# EAGLE design SparkFun_Buck-Boost (EAGLE 9.1.1)
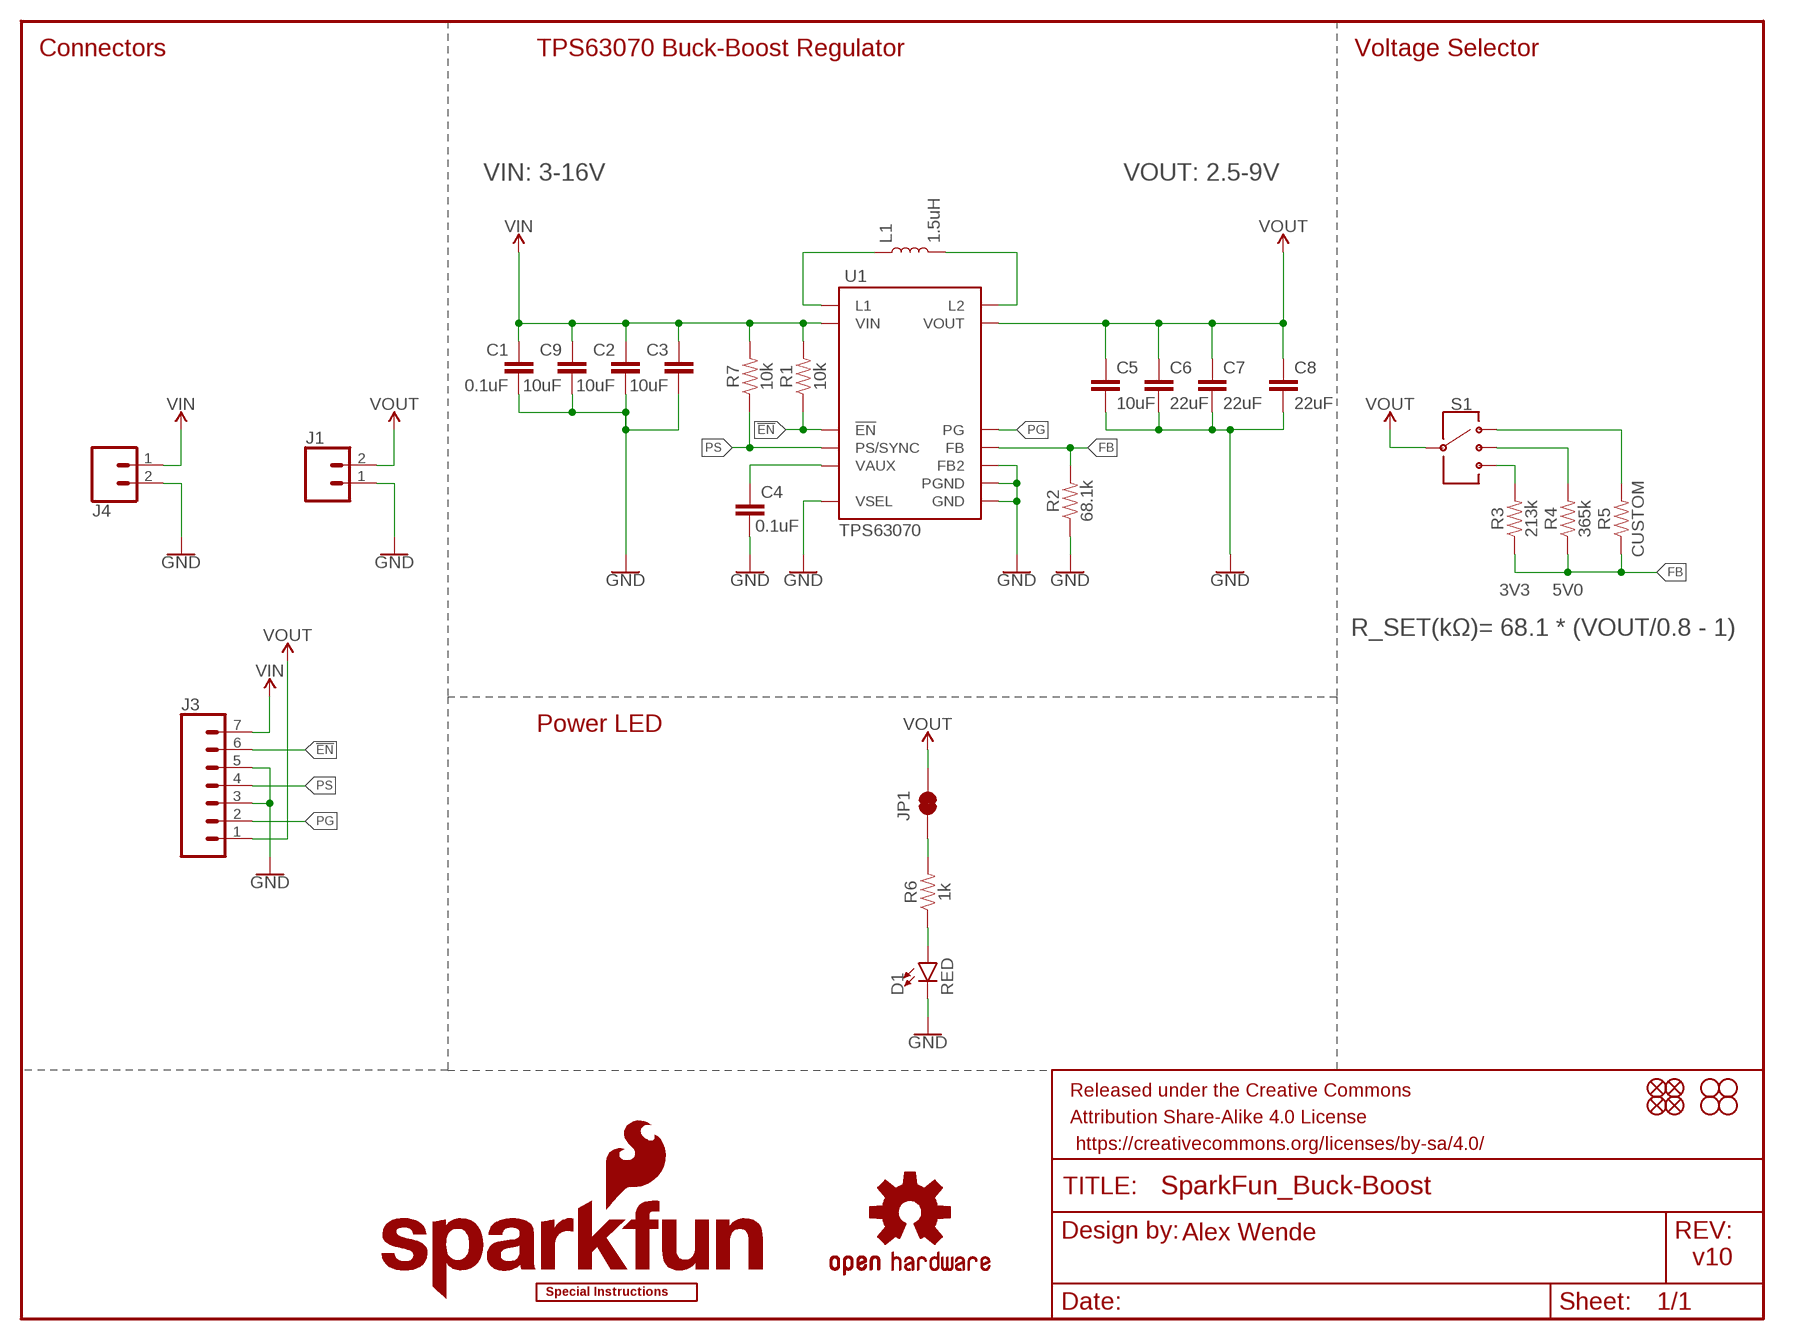
[diagram p0: schematic, sheet 1]

## Parts
C1  0.1uF  0.1UF-0603-25V-(+80/-20%)  [0603]
C2  10uF  10UF-0805-25V-10%  [0805]
C3  10uF  10UF-0805-25V-10%  [0805]
C4  0.1uF  0.1UF-0603-25V-(+80/-20%)  [0603]
C5  10uF  10UF-0805-25V-10%  [0805]
C6  22uF  22UF-0805-16V-20%  [0805]
C7  22uF  22UF-0805-16V-20%  [0805]
C8  22uF  22UF-0805-16V-20%  [0805]
C9  10uF  10UF-0805-25V-10%  [0805]
D1  RED  LED-RED0603  [LED-0603]
FD1  FIDUCIALUFIDUCIAL  [FIDUCIAL-MICRO]
FD2  FIDUCIALUFIDUCIAL  [FIDUCIAL-MICRO]
FD3  FIDUCIALUFIDUCIAL  [FIDUCIAL-MICRO]
FD4  FIDUCIALUFIDUCIAL  [FIDUCIAL-MICRO]
FRAME1  FRAME-LETTER  [CREATIVE_COMMONS]
H1  STAND-OFF  [STAND-OFF]
H2  STAND-OFF  [STAND-OFF]
H3  STAND-OFF  [STAND-OFF]
H4  STAND-OFF  [STAND-OFF]
J1  CONN_023.5MM-NO_SILK  [SCREWTERMINAL-3.5MM-2-NS]
J3  CONN_07NO_SILK  [1X07_NO_SILK]
J4  CONN_023.5MM-NO_SILK  [SCREWTERMINAL-3.5MM-2-NS]
JP1  JUMPER-SMT_2_NC_TRACE_NO-SILK  [SMT-JUMPER_2_NC_TRACE_NO-SILK]
L1  1.5uH  INDUCTOR-XFL40201.5UH  [XFL4020]
LOGO1  SFE_LOGO_NAME_FLAME.1_INCH  [SFE_LOGO_NAME_FLAME_.1]
LOGO2  OSHW-LOGOS  [OSHW-LOGO-S]
LOGO3  SPECIAL_INSTRUCTIONS-ORDERING  [ORDERING_INSTRUCTIONS]
R1  10k  10KOHM-0603-1/10W-1%  [0603]
R2  68.1k  68.1KOHM-0603-1/10W-1%  [0603]
R3  213k  213KOHM-0603-1/10W-0.1%  [0603]
R4  365k  365KOHM-0603-1/10W-1%  [0603]
R5  CUSTOM  RESISTORAXIAL-0.3  [AXIAL-0.3]
R6  1k  1KOHM-0603-1/10W-1%  [0603]
R7  10k  10KOHM-0603-1/10W-1%  [0603]
S1  SWITCH-SP3T-SMD  [SWITCH_SP3T_SMD]
U1  TPS63070  [VQFN-15-HR(3X2.5)]

## Nets
!EN: J3.6 R1.1 U1.P$14(!EN)
FB: R2.2 R3.1 R4.1 R5.P$1 U1.P$5(FB)
GND: C1.2 C2.2 C3.2 C4.2 C5.2 C6.2 C7.2 C8.2 C9.2 D1.C J1.1 J3.3 J3.5 J4.2 R2.1 U1.P$4(GND) U1.P$6(FB2) U1.P$10(PGND) U1.P$15(VSEL)
N$1: L1.P$1 U1.P$11(L1)
N$2: L1.P$2 U1.P$9(L2)
N$4: R5.P$2 S1.1
N$5: R4.2 S1.2
N$6: C4.1 U1.P$3(VAUX)
N$7: R3.2 S1.4
N$8: JP1.1 R6.2
N$9: D1.A R6.1
PG: J3.2 U1.P$2(PG)
PS: J3.4 R7.1 U1.P$1(PS/SYNC)
VIN: C1.1 C2.1 C3.1 C9.1 J3.7 J4.1 R1.2 R7.2 U1.P$12/13(VIN)
VOUT: C5.1 C6.1 C7.1 C8.1 J1.2 J3.1 JP1.2 S1.3 U1.P$7/8(VOUT)

## Notes on the sheet
- Connectors | TPS63070 Buck-Boost Regulator | Voltage Selector
- VIN: 3-16V | VOUT: 2.5-9V
- 3V3 | 5V0
- R_SET(kΩ)= 68.1 * (VOUT/0.8 - 1)
- Power LED
- Alex Wende
- v10

## Library data of the parts
C1 C4 = SparkFun-Capacitors:0.1UF: 0.1µF ceramic capacitors A capacitor is a passive two-terminal electrical component used to store electrical energy temporarily in an electric field.; PROD_ID: CAP-00810
C2 C3 C5 C9 = SparkFun-Capacitors:10UF: 10.0µF ceramic capacitors A capacitor is a passive two-terminal electrical component used to store electrical energy temporarily in an electric field.; PROD_ID: CAP-14259
C6-C8 = SparkFun-Capacitors:22UF: 22µF ceramic capacitors A capacitor is a passive two-terminal electrical component used to store electrical energy temporarily in an electric field.; PROD_ID: CAP-14260
D1 = SparkFun-LED:LED-RED: Red SMD LED Used in manufacturing of most products at SparkFun Packages: 0603 - SMD 0603 package [Product Link] <http://docs.avagotech.com/docs/AV02-0551EN> 0603 SMART - SMD 0603 SMART package ( more efficient and expensive)[Product Link] <http://www.osram-os.com/Graphics/XPic2/00077099_0.pdf> 1206 - SMD1206 package [Product Link] <https://www.sparkfun.com/datasheets/DevTools/LilyPad/Q150OVS4.pdff> SparkFun Products: Pro Mini 328 -5V <https://www.sparkfun.com/products/821> RedBoard <https://www.sparkfun.com/products/12757> IOIO-OTG <https://www.sparkfun.com/products/13613>; PROD_ID: DIO-00819
FD1-FD4 = SparkFun-Aesthetics:FIDUCIAL: Fiducial Alignment Points Point-of-reference for pick-and-place machines and other optical instruments.
FRAME1 = SparkFun-Aesthetics:FRAME-LETTER: Schematic Frame - Letter Standard 8.5x11 US Letter frame
H1-H4 = SparkFun-Hardware:STAND-OFF: Stand Off Drill holes for mechanically mounting via screws, standoffs, etc. Note: Use the keepout ring to avoid running the screw head into surrounding components. Variant Overviews STAND-OFF - Mechanical footprint for a #4 phillips button head screw. STAND-OFF-TIGHT - Mechanical footprint for a #4 phillips button head screw, Example SparkFun Products Screw - Phillips Head (1/4", 4-40, 10 pack) <https://www.sparkfun.com/products/10453> (PRT-10453) Screw - Phillips Head (1/2", 4-40, 10 pack) <https://www.sparkfun.com/products/10452> (PRT-10452) Screw - Phillips Head (3/4", 4-40, 10 pack) <https://www.sparkfun.com/products/10451> (PRT-10451) Screw - Phillips Head (1", 4-40, 10 pack) <https://www.sparkfun.com/products/10450> (PRT-10450)
J1 J4 = SparkFun-Connectors:CONN_02: Multi connection point. Often used as Generic Header-pin footprint for 0.1 inch spaced/style header connections On any of the 0.1 inch spaced packages, you can populate with these: Break Away Headers - Straight <https://www.sparkfun.com/products/116> (PRT-00116) Break Away Male Headers - Right Angle <https://www.sparkfun.com/products/553> (PRT-00553) Female Headers <https://www.sparkfun.com/products/115> (PRT-00115) Break Away Headers - Machine Pin <https://www.sparkfun.com/products/117> (PRT-00117) Break Away Female Headers - Swiss Machine Pin <https://www.sparkfun.com/products/743> (PRT-00743) For SCREWTERMINALS and SPRING TERMINALS visit here: Screw Terimnals on SparkFun.com <https://www.sparkfun.com/search/results?term=Screw+Terminals> (5mm/3.5mm/2.54mm spacing) This device is also useful as a general connection point to wire up your design to another part of your project. Our various solder wires solder well into these plated through hole pads. Hook-Up Wire - Assortment (Stranded, 22 AWG) <https://www.sparkfun.com/products/11375> (PRT-11375) Hook-Up Wire - Assortment (Solid Core, 22 AWG) <https://www.sparkfun.com/products/11367> (PRT-11367) View the entire wire category on our website here <https://www.sparkfun.com/categories/141> Special notes: Molex polarized connector foot print use with: PRT-08233 with associated crimp pins and housings. 2.54_SCREWTERM for use with PRT-10571. 3.5mm Screw Terminal footprints for PRT-08084 5mm Screw Terminal footprints for use with PRT-08432; PROD_ID: CONN-08399
J3 = SparkFun-Connectors:CONN_07: Multi connection point. Often used as Generic Header-pin footprint for 0.1 inch spaced/style header connections On any of the 0.1 inch spaced packages, you can populate with these: Break Away Headers - Straight <https://www.sparkfun.com/products/116> (PRT-00116) Break Away Male Headers - Right Angle <https://www.sparkfun.com/products/553> (PRT-00553) Female Headers <https://www.sparkfun.com/products/115> (PRT-00115) Break Away Headers - Machine Pin <https://www.sparkfun.com/products/117> (PRT-00117) Break Away Female Headers - Swiss Machine Pin <https://www.sparkfun.com/products/743> (PRT-00743) For SCREWTERMINALS and SPRING TERMINALS visit here: Screw Terimnals on SparkFun.com <https://www.sparkfun.com/search/results?term=Screw+Terminals> (5mm/3.5mm/2.54mm spacing) This device is also useful as a general connection point to wire up your design to another part of your project. Our various solder wires solder well into these plated through hole pads. Hook-Up Wire - Assortment (Stranded, 22 AWG) <https://www.sparkfun.com/products/11375> (PRT-11375) Hook-Up Wire - Assortment (Solid Core, 22 AWG) <https://www.sparkfun.com/products/11367> (PRT-11367) View the entire wire category on our website here <https://www.sparkfun.com/categories/141> Special notes: Molex polarized connector foot print use with SKU : PRT-08231 with associated crimp pins and housings. 1MM SMD Version SKU: PRT-10208 NOTES ON THE VARIANTS LOCK and LOCK_LONGPADS... This footprint was designed to help hold the alignment of a through-hole component (i.e. 6-pin header) while soldering it into place. You may notice that each hole has been shifted either up or down by 0.005 of an inch from it's more standard position (which is a perfectly straight line). This slight alteration caused the pins (the squares in the middle) to touch the edges of the holes. Because they are alternating, it causes a "brace" to hold the component in place. 0.005 has proven to be the perfect amount of "off-center" position when using our standard breakaway headers. Although looks a little odd when you look at the bare footprint, once you have a header in there, the alteration is very hard to notice. Also,if you push a header all the way into place, it is covered up entirely on the bottom side.
JP1 = SparkFun-Jumpers:JUMPER-SMT_2_NC_TRACE: Normally closed trace jumper This jumper has a trace between two pads so it's normally closed (NC). Use a razor knife to open the connection. For best results follow the IPC guidelines for cutting traces: Cutout at least 0.063 mm (0.005 in). Remove all loose material to clean up the cut area. Seal the cut with an approved epoxy. Reapply solder to reclose the connection.
L1 = SparkFun-Coils:INDUCTOR-XFL4020; PROD_ID: INDUC-13855
LOGO1 = SparkFun-Aesthetics:SFE_LOGO_NAME_FLAME: SparkFun Font Logo w/ Flame This is the SparkFun full logo. The logo on the schematic will always be the same size; the package variant is the height of the flame part of the logo. Default layer for the logo on the board is tSilk.
LOGO2 = SparkFun-Aesthetics:OSHW-LOGO: Open-Source Hardware (OSHW) Logo This logo indicates the piece of hardware it is found on incorporates a OSHW license and/or adheres to the definition of open source hardware found here: http://freedomdefined.org/OSHW
LOGO3 = SparkFun-Aesthetics:SPECIAL_INSTRUCTIONS: Special Ordering/Production Instructions Alert Symbol for special PCB ordering instructions or unique production process warnings. Ordering Instructions Production Instructions Types of information that should be added to box: Copper weight Soldermask color Silk color PCB thickness Number of layers PCB Standard: 1.6mm FR4 1 oz copper immersion silver plating red soldermask white silkscreen Types of information that should be added to box: Special wash requirements Depaneling instructions Humidification Glue curing Default text settings: 0.07 inch 9% ratio 50% line distance
R1 R7 = SparkFun-Resistors:10KOHM: 10kΩ resistor A resistor is a passive two-terminal electrical component that implements electrical resistance as a circuit element. Resistors act to reduce current flow, and, at the same time, act to lower voltage levels within circuits. - Wikipedia; PROD_ID: RES-00824
R2 = SparkFun-Resistors:68.1KOHM: 68.1kΩ resistor A resistor is a passive two-terminal electrical component that implements electrical resistance as a circuit element. Resistors act to reduce current flow, and, at the same time, act to lower voltage levels within circuits. - Wikipedia; PROD_ID: RES-09380
R3 = SparkFun-Resistors:213KOHM; PROD_ID: RES-14261
R4 = SparkFun-Resistors:365KOHM; PROD_ID: RES-14262
R5 = SparkFun-Resistors:RESISTOR: Generic Resistor Package
R6 = SparkFun-Resistors:1KOHM: 1kΩ resistor A resistor is a passive two-terminal electrical component that implements electrical resistance as a circuit element. Resistors act to reduce current flow, and, at the same time, act to lower voltage levels within circuits. - Wikipedia; PROD_ID: RES-07856
S1 = SparkFun-Switches:SWITCH-SP3T: Single-Pole, Triple-Throw (SP3T) Switch Single-Pole, Triple-Throw switches SparkFun Products Prototype Part; PROD_ID: SWCH-10805
U1 = SparkFun-IC-Power:TPS63070; PROD_ID: IC-14258

## Board
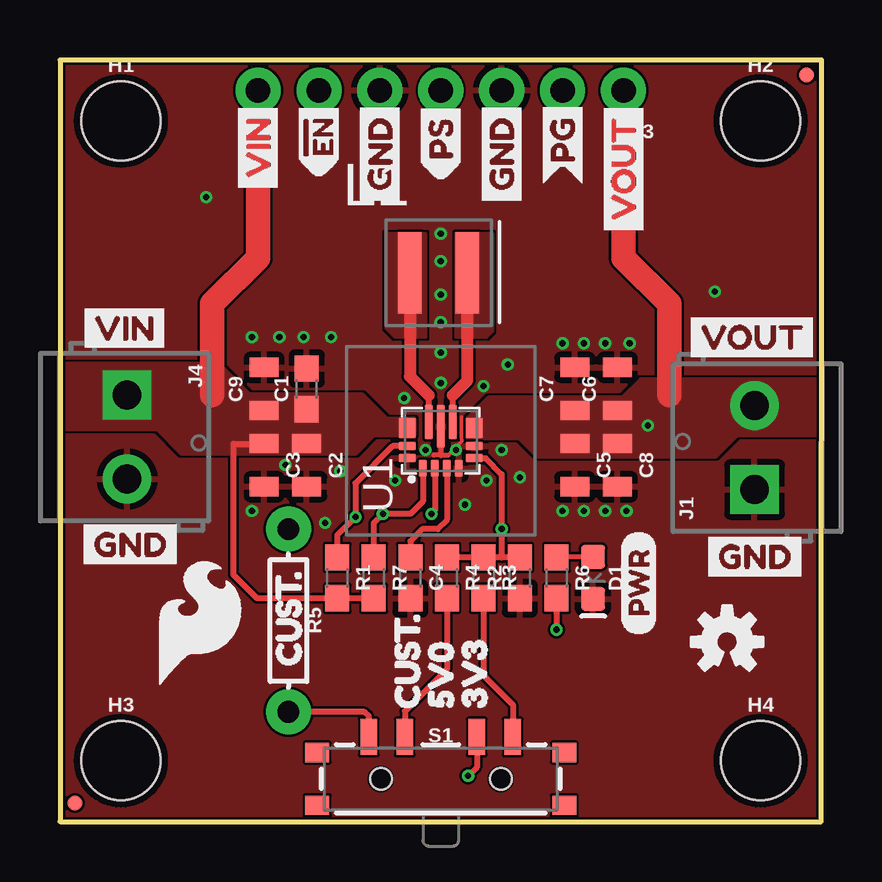
[diagram p1: board, top side]
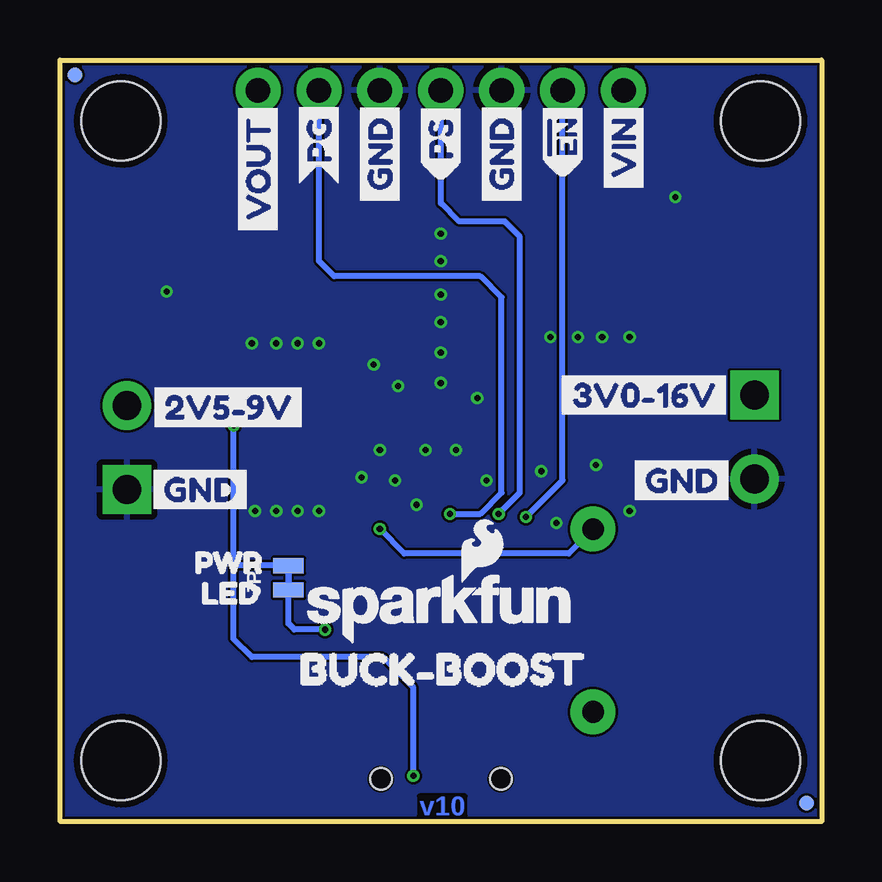
[diagram p2: board, bottom side, seen from below]

Size 31.75 x 31.75 mm. Coordinates in mm from the lower left corner, seen from the top.
Outline: 0,0 31.73,0 31.75,31.75 0,31.75 0,0
Copper layers (1*16): Top 0.035mm / dielectric 1.5mm / Bottom 0.035mm
Design rules "SparkFun-2-layer-FAB-LIMIT": minimum track width 4mil, minimum drill 6mil, track to track 4mil, track to pad 4mil, pad to pad 4mil, via to via 4mil, smd to smd 4mil, copper to edge 4mil, drill to drill 4mil, minimum pad ring 5mil, minimum via ring 5mil, stop-mask expansion 4mil, vias tented up to drill 25mil, thermal gap 10mil

### Footprints (pad centres in the part's own frame; a part is rotated, then mirrored left to right if it is on the bottom)
0603 = smd 1.1 x 1: 1 -0.85,0; 2 0.85,0
0805 = smd 0.8 x 1.2: 1 -0.9,0; 2 0.9,0
LED-0603 = smd 1 x 1: A -0.877,0; C 0.877,0
FIDUCIAL-MICRO = smd 0.635 x 0.635: 1 0,0
STAND-OFF = hole 3.302: 0,0
SCREWTERMINAL-3.5MM-2-NS = drill 1.2 pad 2.032 square: 1 0,0 | drill 1.2 pad 2.032: 2 3.5,0
1X07_NO_SILK = drill 1.016 pad 1.88: 1 0,0; 2 2.54,0; 3 5.08,0; 4 7.62,0; 5 10.16,0; 6 12.7,0; 7 15.24,0
SMT-JUMPER_2_NC_TRACE_NO-SILK = smd 0.635 x 1.27: 1 -0.508,0; 2 0.508,0
XFL4020 = smd 0.98 x 3.4: P$1 1,1.8; P$2 3.4,1.8
AXIAL-0.3 = drill 0.9 pad 1.88: P$1 -3.81,0; P$2 3.81,0
SWITCH_SP3T_SMD = smd 0.7 x 1.5: 1 3,-1.75; 2 1.5,-1.75; 3 -1.5,-1.75; 4 -3,-1.75 | smd 1 x 0.8: P$1 -5.15,-1.1; P$2 -5.15,1.1; P$3 5.15,1.1; P$4 5.15,-1.1 | hole 0.9: 2.5,0; -2.5,0
VQFN-15-HR(3X2.5) = smd 0.7 x 0.35: P$1 -1.15,0.75; P$2 -1.15,0.25; P$3 -1.15,-0.25; P$4 -1.15,-0.75 | smd 0.35 x 0.7: P$5 -0.725,-1.4; P$6 -0.225,-1.4; P$14 -0.225,1.4; P$15 -0.725,1.4 | smd 0.85 x 0.7: P$7/8 0.525,-1.4; P$12/13 0.525,1.4 | smd 1.45 x 0.35: P$9 0.775,-0.5; P$11 0.775,0.5 | smd 1.8 x 0.35: P$10 0.6,0

### Placement (x,y rotation side)
C1  10.29,18.03 90 top
C2  10.29,14.86 270 top
C3  8.51,14.86 270 top
C4  14.61,10.16 270 top
C5  21.46,14.86 270 top
C6  23.24,18.03 90 top
C7  21.46,18.03 90 top
C8  23.24,14.86 270 top
C9  8.51,18.03 90 top
D1  22.23,10.16 270 top
FD1  31.11,31.11 0 top
FD2  31.11,31.11 0 bottom
FD3  0.64,0.76 0 top
FD4  0.64,0.76 0 bottom
FRAME1  -13.97,-19.05 0 top  (outside the outline)
H1  2.54,29.21 0 top
H2  29.21,29.21 0 top
H3  2.54,2.54 0 top
H4  29.21,2.54 0 top
J1  28.96,13.84 90 top
J3  23.5,30.48 180 top
J4  2.79,17.78 270 top
JP1  22.23,10.16 90 bottom
L1  13.59,21.08 0 top
LOGO1  15.88,8.89 0 bottom
LOGO2  27.81,7.49 0 top
LOGO3  -34.29,-20.32 0 top  (outside the outline)
R1  11.56,10.16 270 top
R2  19.18,10.16 90 top
R3  17.65,10.16 270 top
R4  16.13,10.16 270 top
R5  9.53,8.38 270 top
R6  20.7,10.16 270 top
R7  13.08,10.16 270 top
S1  15.88,1.78 180 top
U1  15.88,15.88 90 top
U$1  [PWR2]  24.13,7.75 90 top
U$2  [CUST#7]  9.53,5.59 90 top
U$3  [VIN0]  8.26,25.91 90 top
U$4  [GND1]  13.34,25.4 90 top
U$5  [VIN3]  0.51,20.57 0 top
U$6  [GND4]  0.51,11.56 0 top
U$7  [GND4]  26.54,11.05 0 top
U$8  [VOUT5]  25.78,20.19 0 top
U$9  [SFE_LOGO_FLAME_.2]  5.84,8.26 0 top
U$10  [3V0#16V6]  11.3,17.78 0 bottom
U$11  [PWR1]  26.92,10.79 0 bottom
U$12  [GND4]  8.26,14.22 0 bottom
U$13  [GND4]  28.32,13.84 0 bottom
U$14  [2V5#9V1]  28.32,17.27 0 bottom
U$15  [BUCK#BOOST18]  22.86,6.35 0 bottom
U$16  [LED0]  26.67,9.53 0 bottom
U$17  [CUST#7]  14.48,3.81 90 top
U$18  [5V08]  15.88,3.81 90 top
U$19  [3V39]  17.27,3.81 90 top
U$20  [GND1]  18.41,25.4 90 top
U$21  [VOUT2]  23.5,24.13 90 top
U$22  [#EN0]  10.79,26.67 90 top
U$23  [PS1]  15.88,26.67 90 top
U$24  [PG2]  20.95,26.54 90 top
U$25  [VIN0]  8.26,25.91 90 bottom
U$26  [VOUT2]  23.5,24.13 90 bottom
U$27  [PG2]  20.95,26.54 90 bottom
U$28  [#EN0]  10.79,26.67 90 bottom
U$29  [PS1]  15.88,26.67 90 bottom
U$30  [GND1]  13.34,25.4 90 bottom
U$31  [GND1]  18.41,25.4 90 bottom

### Tracks (layer width: path | path; a pad name or v marks a point on that pad's centre or on a via)
!EN  (via drill 0.25)
  Top 0.254: U1.P$14 13.87,15.65 12.32,14.1 v12.32,12.7 11.56,11.94 R1.1
  Bottom 0.254: v12.32,12.7 10.79,14.22 J3.6
FB  (via drill 0.25)
  Top 0.254: U1.P$5 17.74,15.15 18.41,14.48 v18.41,12.19 18.41,11.94 18.41,11.01 | R2.2 18.41,11.01 | 18.41,11.01 R3.1 R4.1
  Bottom 0.254: R5.P$1 10.54,11.18 17.4,11.18 v18.41,12.19
GND  (via drill 0.25)
  Top 0.152: 16.17,15.28 16.76,15.88 16.76,15.91 16.75,15.93 16.75,16.87
  Top 0.203: U1.P$10 15.88,15.28 | 15.88,15.28 16.17,15.28 | 15.88,15.28 15.58,15.28
  other vias: 15.88,18.29 13.97,14.22 15.88,19.56 15.88,20.83 15.88,21.97 20.95,19.94 21.84,19.94 22.73,19.94 23.75,19.94 17.78,14.22 18.41,15.49 15.24,15.49 16.51,15.49 20.95,12.95 21.84,12.95 22.73,12.95 23.62,12.95 11.05,12.45 11.68,14.61 8,12.95 9.4,14.86 11.3,20.19 9.14,20.19 8,20.19 17.65,18.16 14.35,17.65 18.67,19.05 16.89,13.21 19.18,14.35 27.3,22.1 6.1,26.04 15.88,23.37 15.88,24.51 10.16,20.19
  pour Top (rank 2): 0,0 0,31.75 31.75,31.75 31.75,0
  pour Bottom (rank 2): 0,0 0,31.75 31.75,31.75 31.75,0
N$1
  Top 0.254: U1.P$11 15.38,17.78
  Top 0.508: L1.P$1 14.59,18.56 15.37,17.78 15.38,17.78
  pour Top (no thermals): 13.59,24.51 15.24,24.51 15.24,20.19 13.97,20.19 13.59,20.57
N$2
  Top 0.254: U1.P$9 16.38,17.78
  Top 0.508: L1.P$2 16.99,18.39 16.38,17.78
  pour Top (no thermals): 16.51,24.51 18.03,24.51 18.03,20.45 17.78,20.19 16.51,20.19
N$4
  Top 0.254: S1.1 12.88,4.4 12.7,4.57 R5.P$2
N$5
  Top 0.254: R4.2 16.13,6.35 14.38,4.6 S1.2
N$6
  Top 0.254: U1.P$3 16.12,12.57 15.75,12.19 15.11,12.19 14.61,11.68 C4.1
N$7
  Top 0.254: R3.2 17.65,6.1 18.88,4.87 S1.4
N$8  (via drill 0.25)
  Top 0.254: R6.2 v20.7,8
  Bottom 0.254: v20.7,8 21.97,8 22.23,8.26 JP1.1
N$9
  Top 0.203: D1.A 20.73,11.04 R6.1
PG  (via drill 0.25)
  Top 0.254: U1.P$2 15.62,12.96 v15.49,12.83
  Bottom 0.254: v15.49,12.83 14.22,12.83 13.34,13.72 13.34,21.84 14.22,22.73 20.32,22.73 20.95,23.37 J3.2
PS  (via drill 0.25)
  Top 0.254: U1.P$1 15.12,13.35 14.61,12.83 v13.46,12.83 13.08,12.45 R7.1
  Bottom 0.254: v13.46,12.83 12.57,13.72 12.57,24.38 13.21,25.02 15.11,25.02 15.88,25.78 J3.4
VIN
  Top 0.254: R7.2 R1.2 8.22,9.31 7.24,10.29 7.24,15.75 8.5,15.75 C3.1
  Top 1.016: J3.7 8.26,23.5 6.35,21.59 6.35,17.78
  pour Top (no thermals): 0,19.05 6.6,19.05 7.87,17.78 12.57,17.78 13.59,16.76 14.73,16.76 14.73,16.13 13.08,16.13 12.32,15.37 5.08,15.37 4.06,16.38 0,16.38
VOUT  (via drill 0.25)
  Top 0.254: S1.3 17.38,2.26 v17.02,1.91
  Top 1.016: J3.1 23.5,23.5 25.4,21.59 25.4,17.78
  Bottom 0.254: v17.02,1.91 17.02,5.59 18.29,6.86 23.75,6.86 24.51,7.62 24.51,10.67 | 24.51,10.67 v24.51,16.51 | 24.51,10.67 23.88,10.67 JP1.2
  pour Top (no thermals): 31.75,18.41 31.75,16.13 28.19,16.13 27.3,15.24 19.94,15.24 19.18,16 17.02,16 17.02,16.76 17.91,17.65 23.5,17.65 24.26,18.41

### Text on the board
Bottom: v10
tDocu: Alex Wende | - 2oz Copper!